# Altium schematic sheet Power-5V.SchDoc: Power +5V
size A3; Organization: Hofmann Travel; SheetNumber: 7; SheetTotal: 10
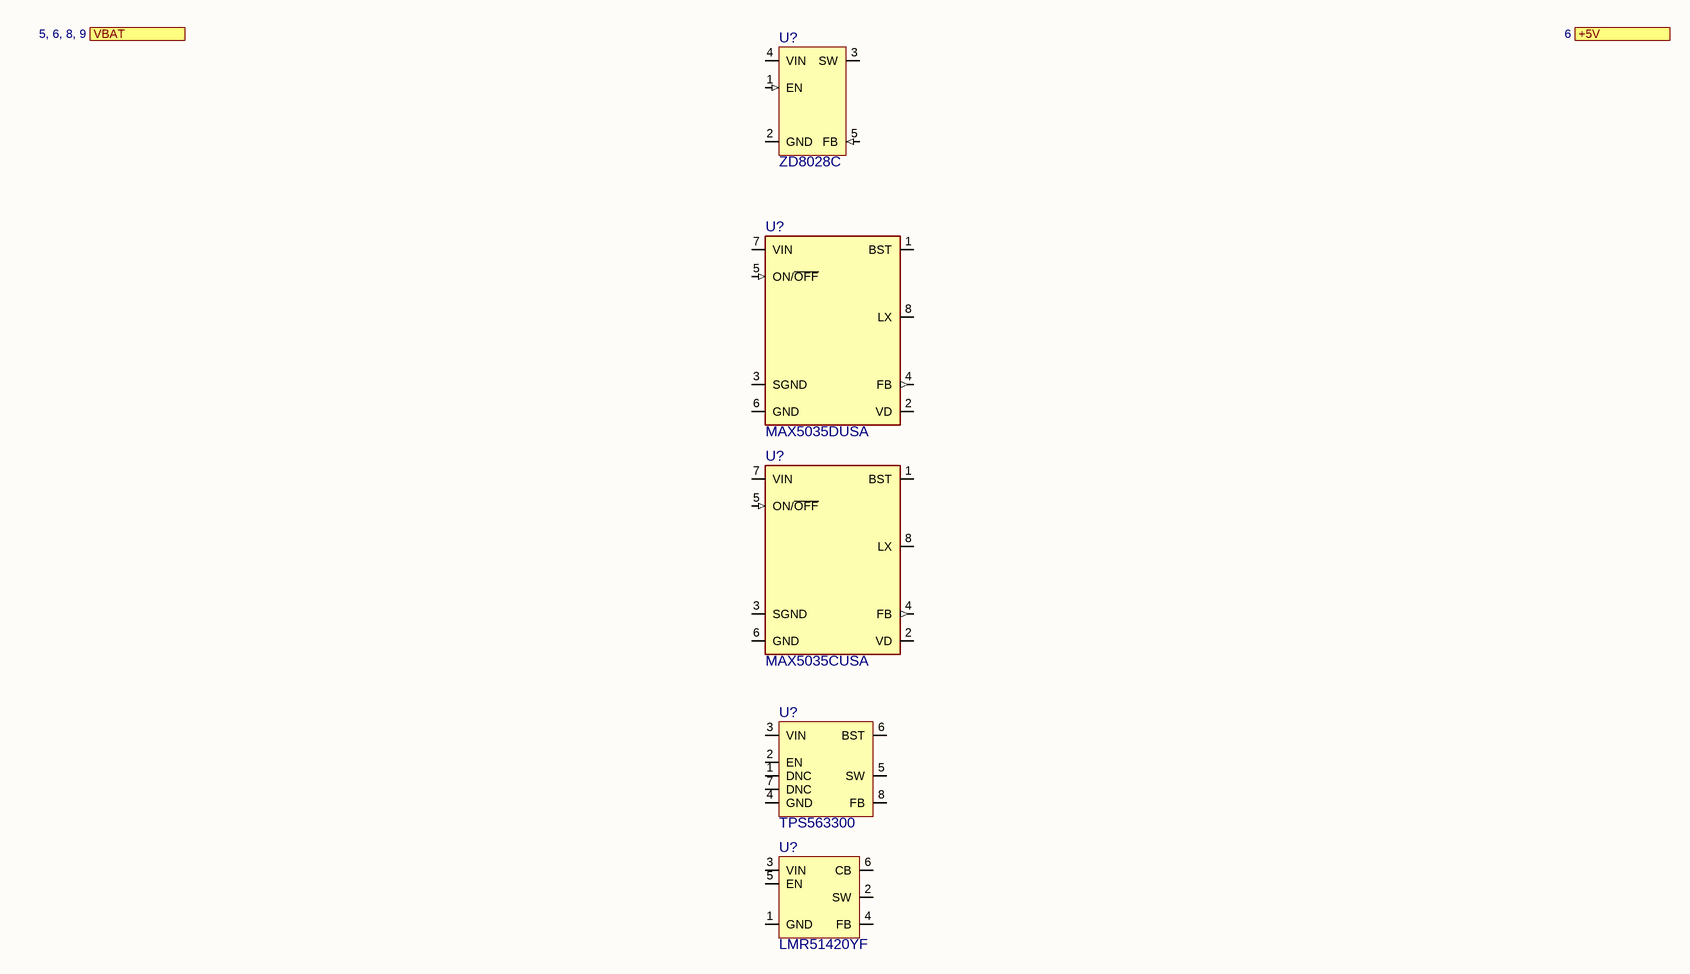
[diagram p0: Power-5V.SchDoc]

## Parts
(Parts that share a designator on the sheet are numbered #1, #2 ... from top to bottom, then left to right.)
U?#1  ZD8028C  [SOT2395P280X125-5-SW]
U?#2  MAX5035DUSA  [SOP127P600X155-8-SW]
U?#3  MAX5035CUSA  [SOP127P600X155-8-SW]
U?#4  TPS563300  [SOT50P160X60-8-SE]
U?#5  LMR51420YF  [SOT2395P280X125-6-NW]

## Ports
+5V (out, see 6), VBAT (in, see 5, 6, 8, 9)

## Nets

Not connected (* = marked no-connect by the designer): U?#1 1(EN) 2(GND) 3(SW) 4(VIN) 5(FB); U?#2 1(BST) 2(VD) 3(SGND) 4(FB) 5(ON/~{OFF}) 6(GND) 7(VIN) 8(LX); U?#3 1(BST) 2(VD) 3(SGND) 4(FB) 5(ON/~{OFF}) 6(GND) 7(VIN) 8(LX); U?#4 1(DNC) 2(EN) 3(VIN) 4(GND) 5(SW) 6(BST) 7(DNC) 8(FB); U?#5 1(GND) 2(SW) 3(VIN) 4(FB) 5(EN) 6(CB)

## Notes on the sheet
- Date:
- Size:
- A3
- Schema:
- Layout:

## Library data of the parts
U?#1 = ZD8028C: 1.5A 2MHz 5.5V Synchronous Buck Converter; Manufacturer: Zetta; Part Number: ZD8028C; Package: SOT23-5; HelpURL: https://datasheet.lcsc.com/lcsc/2203221830_Zetta-ZD8028IB5TR_C2928932.pdf; Manufacturer 3: Zetta; Manufacturer Part Number 3: ZD8028IB5TR; Supplier 3: LCSC; Supplier Part Number 3: C2928932; JLC Type: Extended
U?#2 = MAX5035DUSA: 1A, 76V Adj, High-Efficiency MAXPower Step-Down DC-DC Converter; Manufacturer: Analog Devices Inc./Maxim Integrated; Manufacturer Part Number 1: MAX5035DUSA+T; Part Number: MAX5035DUSA; Package: SOIC-8; HelpURL: https://www.analog.com/media/en/technical-documentation/data-sheets/max5035.pdf; Manufacturer 1: Analog Devices Inc./Maxim Integrated; Supplier 1: Digi-Key; Supplier Part Number 1: MAX5035DUSA+TCT-ND; Manufacturer 3: Analog Devices Inc./Maxim Integrated; Manufacturer Part Number 3: MAX5035DASA+T; Supplier 3: LCSC; Supplier Part Number 3: C15940
U?#3 = MAX5035CUSA: 1A 76V to 12V High-Efficiency MAXPower Step-Down DC-DC Converter; Manufacturer: Analog Devices Inc./Maxim Integrated; Manufacturer Part Number 1: MAX5035CUSA+; Part Number: MAX5035CUSA; Package: SOIC-8; HelpURL: https://www.analog.com/media/en/technical-documentation/data-sheets/max5035.pdf; Manufacturer 1: Analog Devices Inc./Maxim Integrated; Supplier 1: Digi-Key; Supplier Part Number 1: MAX5035CUSA+-ND
U?#4 = TPS563300: 3.8-V to 28-V, 3-A Synchronous Buck Converter in SOT583 Package; Manufacturer: Texas Instruments; Manufacturer Part Number 1: TPS563300DRLR; Part Number: TPS563300; Package: SOT-583; HelpURL: https://www.ti.com/lit/ds/symlink/tps563300.pdf; Manufacturer 1: Texas Instruments; Supplier 1: Digi-Key; Supplier Part Number 1: TPS563300DRLR; Manufacturer 3: Texas Instruments; Manufacturer Part Number 3: TPS563300DRLR; Supplier 3: LCSC; Supplier Part Number 3: C5219249
U?#5 = LMR51420YF: SIMPLE SWITCHER® power converter 4.5-V to 36-V, 2-A, synchronous buck with 40-µA IQ; Manufacturer: Texas Instruments; Manufacturer Part Number 1: LMR51420YFDDCR; Part Number: LMR51420YF; Package: SOIC-8; HelpURL: https://www.ti.com/lit/ds/symlink/lmr51420.pdf; Manufacturer 1: Texas Instruments; Supplier 1: Digi-Key; Supplier Part Number 1: 296-LMR51420YFDDCRCT-ND; Manufacturer 3: Texas Instruments; Manufacturer Part Number 3: LMR51420YFDDCR; Supplier 3: LCSC; Supplier Part Number 3: C7296200